# EAGLE design eps_flatsat_module (EAGLE 9.5.1)

## Sheet 1 of 2
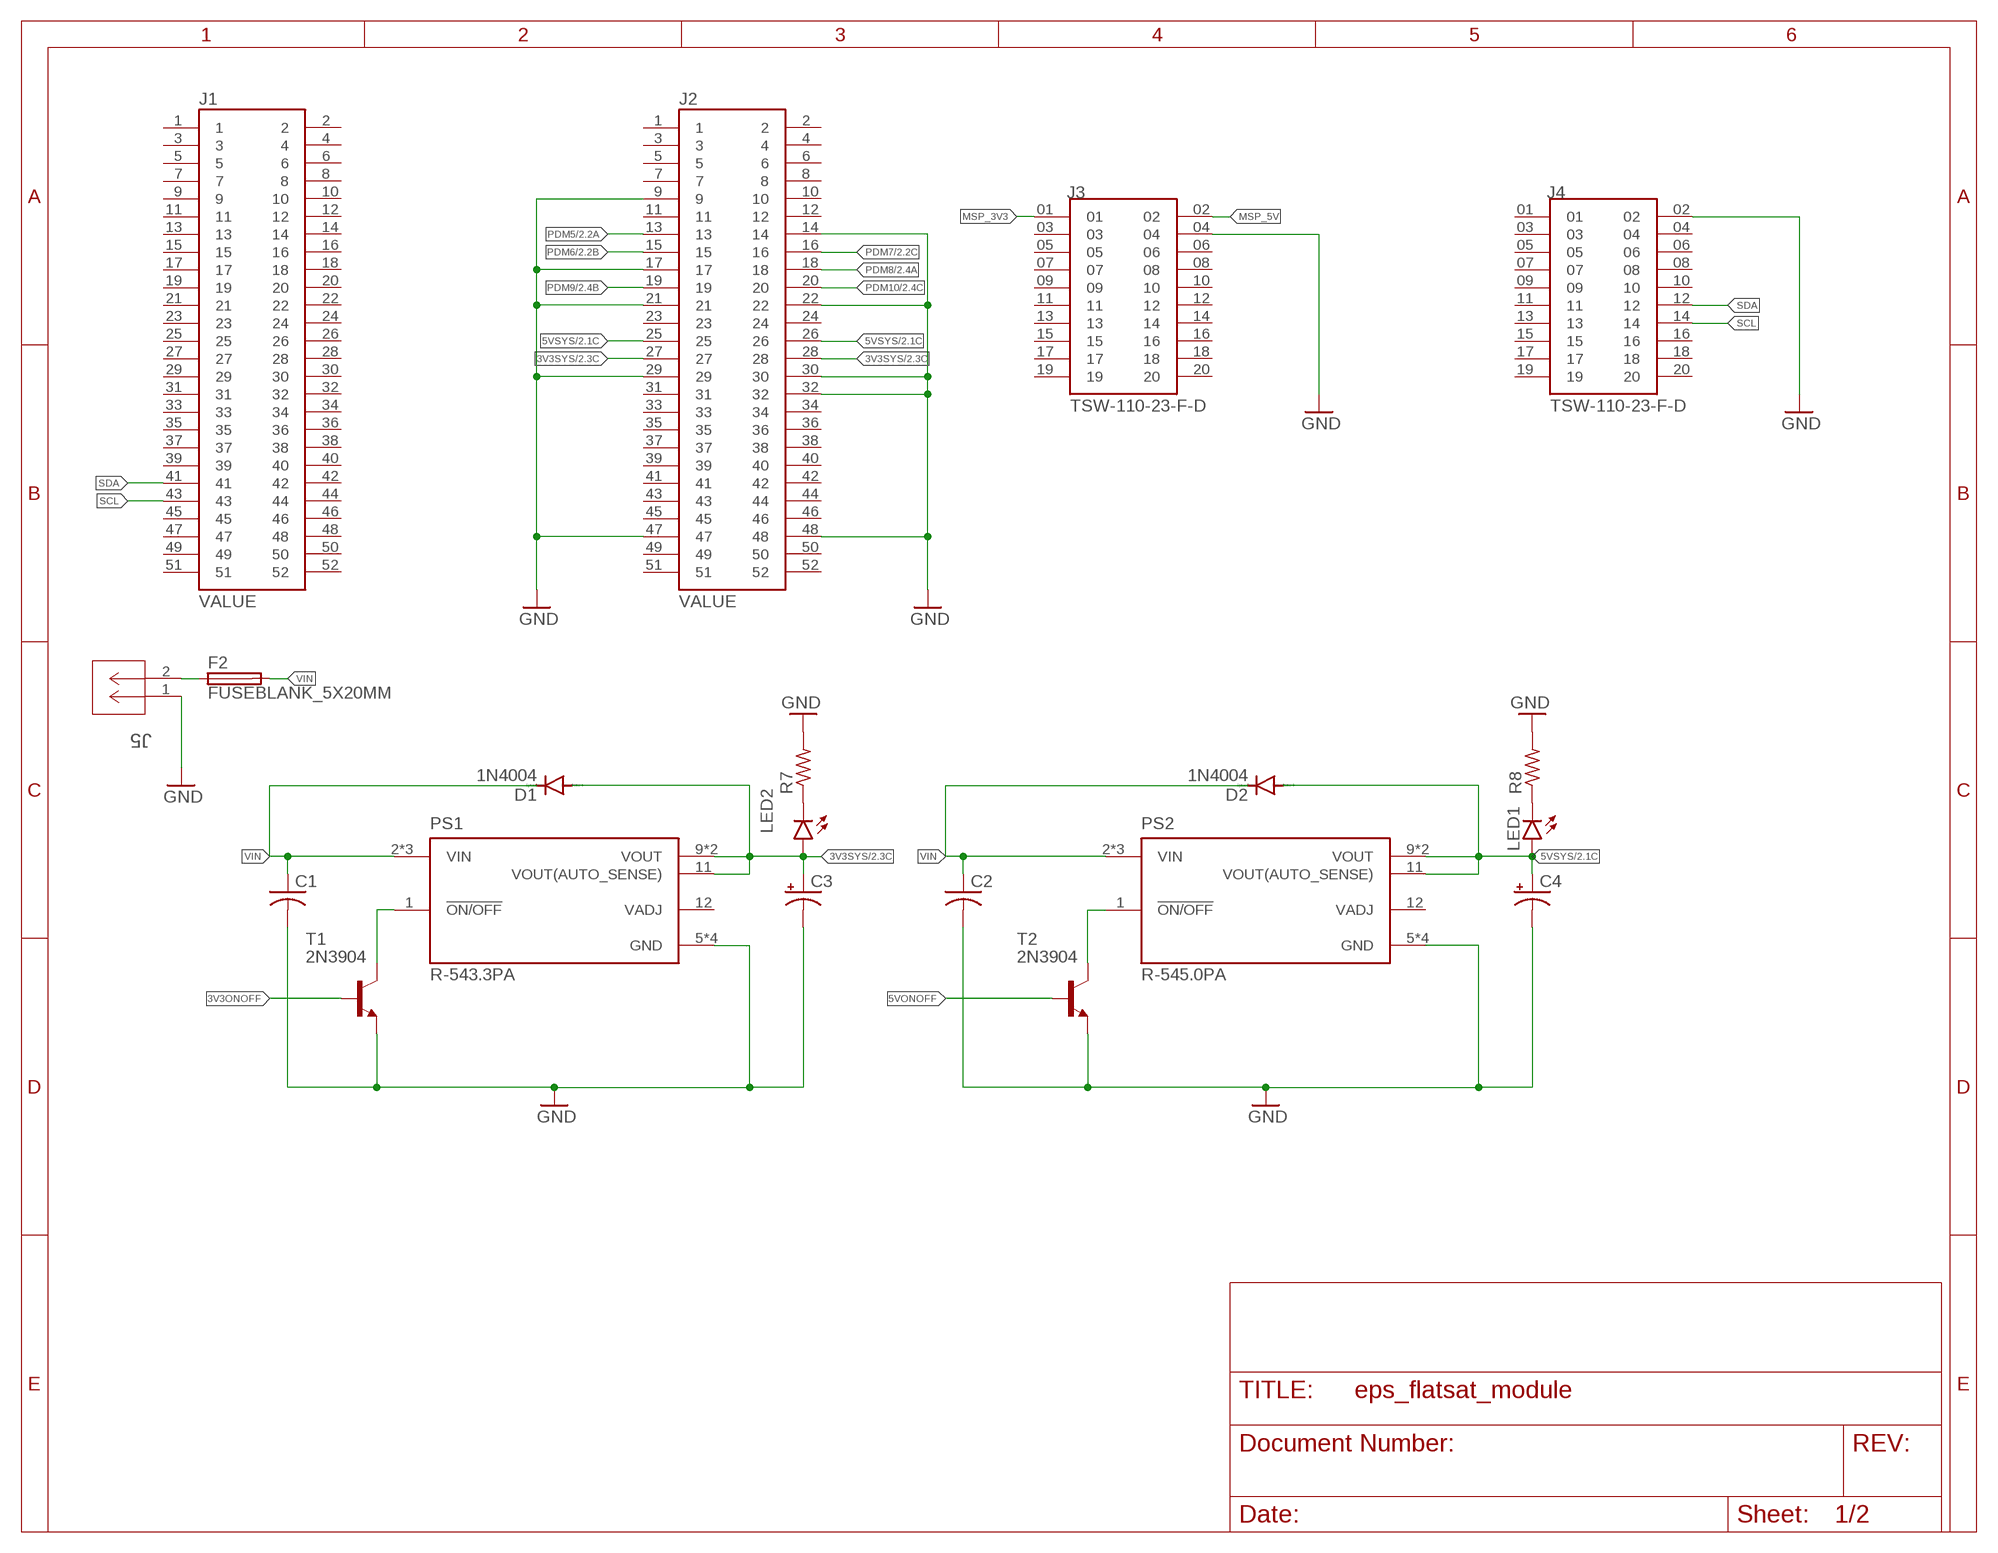
[diagram p0: schematic, sheet 1]

### Parts
C1  C-USC0805  [C0805]
C2  C-USC0805  [C0805]
C3  CPOL-USE2.5-6  [E2,5-6]
C4  CPOL-USE2.5-6  [E2,5-6]
D1  1N4004  [DO41-10]
D2  1N4004  [DO41-10]
F2  FUSEBLANK_5X20MM  [FUSE_HOLDER_5X20MM]
J1  ESQ-126-39-G-D  [SAMTEC_ESQ-126-39-G-D]
J2  ESQ-126-39-G-D  [SAMTEC_ESQ-126-39-G-D]
J3  TSW-110-23-F-D  [SAMTEC_TSW-110-23-F-D]
J4  TSW-110-23-F-D  [SAMTEC_TSW-110-23-F-D]
J5  1985881  [CONN_1715022_PXC]
LED1  LEDCHIPLED_0805  [CHIPLED_0805]
LED2  LEDCHIPLED_0805  [CHIPLED_0805]
PS1  R-543.3PA  [CONV_R-543.3PA]
PS2  R-545.0PA  [CONV_R-545.0PA]
R7  R-US_R0805  [R0805]
R8  R-US_R0805  [R0805]
T1  2N3904  [TO92]
T2  2N3904  [TO92]

### Nets
3V3ONOFF: T1.2(B)
3V3SYS [power]: C3.+ D1.A J2.27 J2.28 LED2.A PS1.9(VOUT) PS1.10(VOUT) PS1.11(VOUT(AUTO_SENSE)) ; also sheet 2
5VONOFF: T2.2(B)
5VSYS [power]: C4.+ D2.A J2.25 J2.26 LED1.A PS2.9(VOUT) PS2.10(VOUT) PS2.11(VOUT(AUTO_SENSE)) ; also sheet 2
GND [power]: C1.2 C2.2 C3.- C4.- J2.9 J2.14 J2.17 J2.21 J2.22 J2.29 J2.30 J2.32 J2.47 J2.48 J3.04 J4.02 J5.1 PS1.5(GND) PS1.6(GND) PS1.7(GND) PS1.8(GND) PS2.5(GND) PS2.6(GND) PS2.7(GND) PS2.8(GND) R7.2 R8.2 T1.3(E) T2.3(E) ; also sheet 2
MSP_3V3 [power]: J3.01
MSP_5V [power]: J3.02
N$1: PS1.1(!ON/OFF) T1.1(C)
N$2: PS2.1(!ON/OFF) T2.1(C)
N$9: LED1.C R8.1
N$10: LED2.C R7.1
N$17 [power]: F2.1 J5.2
PDM5 [power]: J2.13 ; also sheet 2
PDM6 [power]: J2.15 ; also sheet 2
PDM7 [power]: J2.16 ; also sheet 2
PDM8 [power]: J2.18 ; also sheet 2
PDM9 [power]: J2.19 ; also sheet 2
PDM10 [power]: J2.20 ; also sheet 2
SCL: J1.43 J4.14
SDA: J1.41 J4.12
VIN [power]: C1.1 C2.1 D1.C D2.C F2.2 PS1.2(VIN) PS1.3(VIN) PS1.4(VIN) PS2.2(VIN) PS2.3(VIN) PS2.4(VIN)
Unconnected: J1.1 J1.2 J1.3 J1.4 J1.5 J1.6 J1.7 J1.8 J1.9 J1.10 J1.11 J1.12 J1.13 J1.14 J1.15 J1.16 J1.17 J1.18 J1.19 J1.20 J1.21 J1.22 J1.23 J1.24 J1.25 J1.26 J1.27 J1.28 J1.29 J1.30 J1.31 J1.32 J1.33 J1.34 J1.35 J1.36 J1.37 J1.38 J1.39 J1.40 J1.42 J1.44 J1.45 J1.46 J1.47 J1.48 J1.49 J1.50 J1.51 J1.52 J2.1 J2.2 J2.3 J2.4 J2.5 J2.6 J2.7 J2.8 J2.10 J2.11 J2.12 J2.23 J2.24 J2.31 J2.33 J2.34 J2.35 J2.36 J2.37 J2.38 J2.39 J2.40 J2.41 J2.42 J2.43 J2.44 J2.45 J2.46 J2.49 J2.50 J2.51 J2.52 J3.03 J3.05 J3.06 J3.07 J3.08 J3.09 J3.10 J3.11 J3.12 J3.13 J3.14 J3.15 J3.16 J3.17 J3.18 J3.19 J3.20 J4.01 J4.03 J4.04 J4.05 J4.06 J4.07 J4.08 J4.09 J4.10 J4.11 J4.13 J4.15 J4.16 J4.17 J4.18 J4.19 J4.20 PS1.12(VADJ) PS2.12(VADJ)

## Sheet 2 of 2
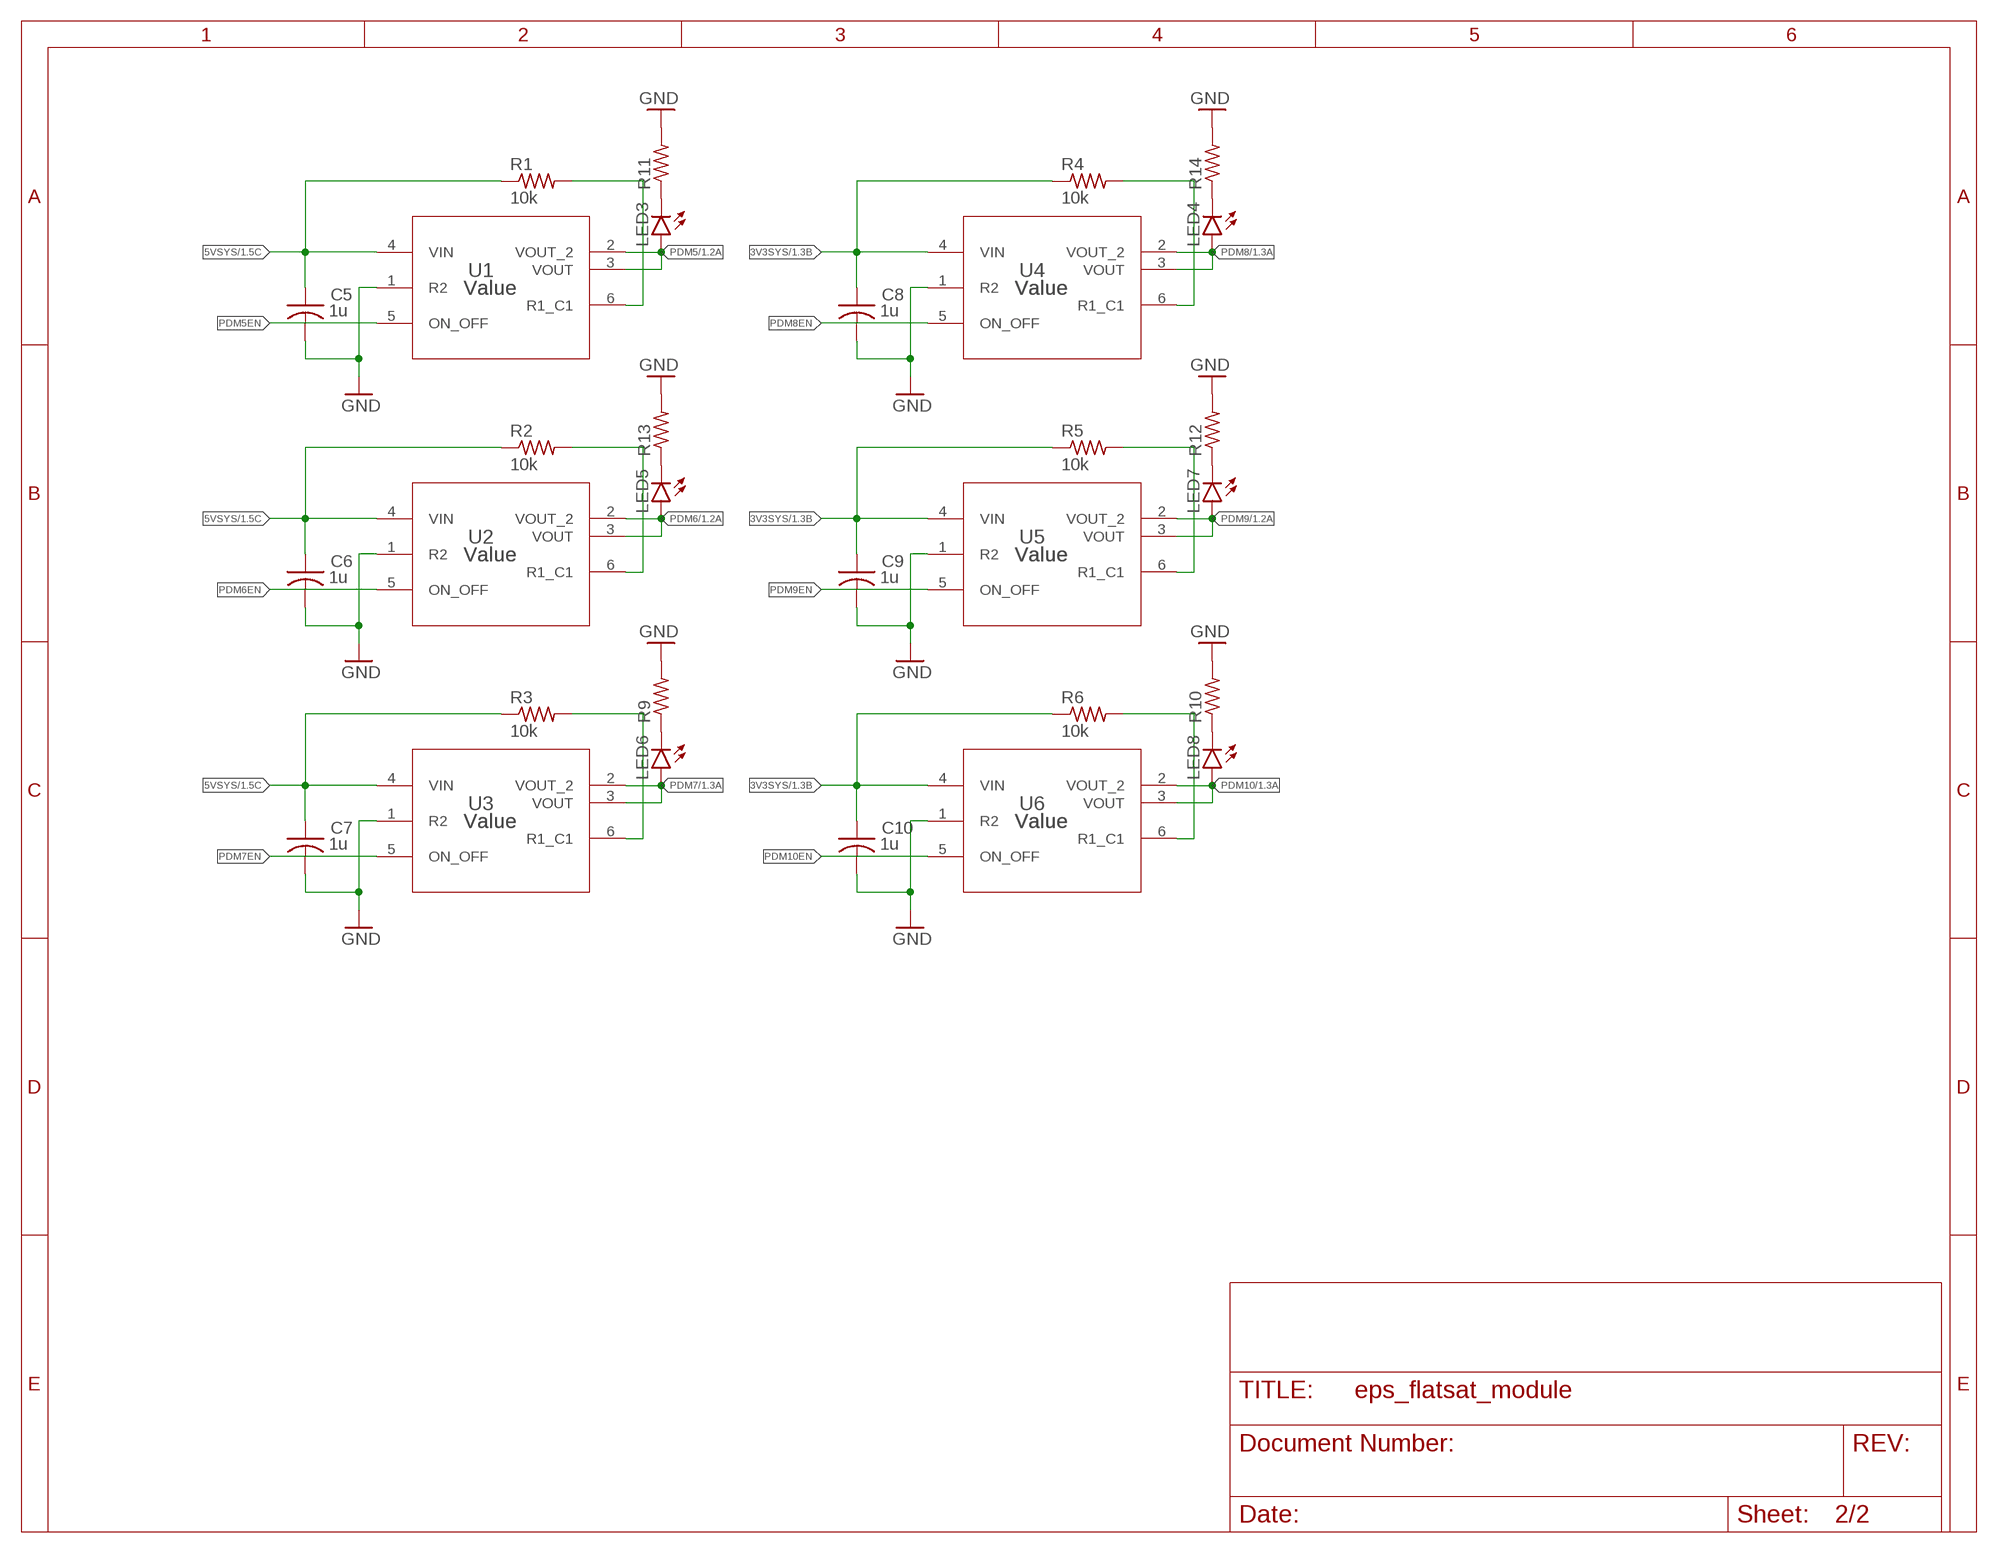
[diagram p1: schematic, sheet 2]

### Parts
C5  1u  C-USC0805  [C0805]
C6  1u  C-USC0805  [C0805]
C7  1u  C-USC0805  [C0805]
C8  1u  C-USC0805  [C0805]
C9  1u  C-USC0805  [C0805]
C10  1u  C-USC0805  [C0805]
LED3  LEDCHIPLED_0805  [CHIPLED_0805]
LED4  LEDCHIPLED_0805  [CHIPLED_0805]
LED5  LEDCHIPLED_0805  [CHIPLED_0805]
LED6  LEDCHIPLED_0805  [CHIPLED_0805]
LED7  LEDCHIPLED_0805  [CHIPLED_0805]
LED8  LEDCHIPLED_0805  [CHIPLED_0805]
R1  10k  R-US_R0805  [R0805]
R2  10k  R-US_R0805  [R0805]
R3  10k  R-US_R0805  [R0805]
R4  10k  R-US_R0805  [R0805]
R5  10k  R-US_R0805  [R0805]
R6  10k  R-US_R0805  [R0805]
R9  R-US_R0805  [R0805]
R10  R-US_R0805  [R0805]
R11  R-US_R0805  [R0805]
R12  R-US_R0805  [R0805]
R13  R-US_R0805  [R0805]
R14  R-US_R0805  [R0805]
U1  Value  TPS27081ADDCR  [DDC0006A_N]
U2  Value  TPS27081ADDCR  [DDC0006A_N]
U3  Value  TPS27081ADDCR  [DDC0006A_N]
U4  Value  TPS27081ADDCR  [DDC0006A_N]
U5  Value  TPS27081ADDCR  [DDC0006A_N]
U6  Value  TPS27081ADDCR  [DDC0006A_N]

### Nets
3V3SYS [power]: C8.1 C9.1 C10.1 R4.1 R5.1 R6.1 U4.4(VIN) U5.4(VIN) U6.4(VIN) ; also sheet 1
5VSYS [power]: C5.1 C6.1 C7.1 R1.1 R2.1 R3.1 U1.4(VIN) U2.4(VIN) U3.4(VIN) ; also sheet 1
GND [power]: C5.2 C6.2 C7.2 C8.2 C9.2 C10.2 R9.2 R10.2 R11.2 R12.2 R13.2 R14.2 U1.1(R2) U2.1(R2) U3.1(R2) U4.1(R2) U5.1(R2) U6.1(R2) ; also sheet 1
N$3: R1.2 U1.6(R1_C1)
N$4: R2.2 U2.6(R1_C1)
N$5: R3.2 U3.6(R1_C1)
N$6: R4.2 U4.6(R1_C1)
N$7: R5.2 U5.6(R1_C1)
N$8: R6.2 U6.6(R1_C1)
N$11: LED6.C R9.1
N$12: LED3.C R11.1
N$13: LED4.C R14.1
N$14: LED7.C R12.1
N$15: LED5.C R13.1
N$16: LED8.C R10.1
PDM5 [power]: LED3.A U1.2(VOUT_2) U1.3(VOUT) ; also sheet 1
PDM5EN: U1.5(ON_OFF)
PDM6 [power]: LED5.A U2.2(VOUT_2) U2.3(VOUT) ; also sheet 1
PDM6EN: U2.5(ON_OFF)
PDM7 [power]: LED6.A U3.2(VOUT_2) U3.3(VOUT) ; also sheet 1
PDM7EN: U3.5(ON_OFF)
PDM8 [power]: LED4.A U4.2(VOUT_2) U4.3(VOUT) ; also sheet 1
PDM8EN: U4.5(ON_OFF)
PDM9 [power]: LED7.A U5.2(VOUT_2) U5.3(VOUT) ; also sheet 1
PDM9EN: U5.5(ON_OFF)
PDM10 [power]: LED8.A U6.2(VOUT_2) U6.3(VOUT) ; also sheet 1
PDM10EN: U6.5(ON_OFF)

## Library data of the parts
C1 C2 C5-C10 = rcl:C-US: CAPACITOR, American symbol; SPICEPREFIX: C
C3 C4 = rcl:CPOL-US: POLARIZED CAPACITOR, American symbol; SPICEPREFIX: C
D1 D2 = diode:1N4004: DIODE general purpose rectifier, 1 A
F2 = fuse:FUSE: Fuse; OC_FARNELL: unknown; OC_NEWARK: unknown
J1 J2 = ESQ-126-39-G-D:ESQ-126-39-G-D: Conn Elevated Socket SKT 52 POS 2.54mm Solder ST Thru-Hole Tube; DESCRIPTION: 52 Position Elevated Socket Connector Through Hole; DIGI-KEY_PART_NUMBER: SAM10462-ND; DIGI-KEY_PURCHASE_URL: https://www.digikey.com/product-detail/en/samtec-inc/ESQ-126-39-G-D/SAM10462-ND/3601055?utm_source=snapeda&utm_medium=aggregator&utm_campaign=symbol; MF: Samtec; MP: ESQ-126-39-G-D; PACKAGE: None
J3 J4 = TSW-110-23-F-D:TSW-110-23-F-D; MANUFACTURER: Samtec; PARTREV: R; STANDARD: Manufacturer Recommendations
J5 = 1985881:1985881; ARTICLE_DESCRIPTION: MKDS 1,5/ 2 HT BK; BUILT_BY: EMA_Matt; CONTACT_TYPE: Unknown; COPYRIGHT: Copyright (C) 2018 Accelerated Designs. All rights reserved; MANUFACTURER_PART_NUMBER: 1985881; NUMBER_OF_CONNECTION: 2; NUMBER_OF_POSITION_PER_ROW: 2; NUMBER_OF_POTENTIALS: 2; NUMBER_OF_ROWS: 1; NUMBER_OF_SOLDER_PINS_PER_POTENTIALS: 1; PITCH__MM_: 5; PLUG_SYSTEM: Unknown; PRODUCTTYP: Printed circuit board terminal; PRODUCT_FAMILY: MKDS 1,5/..-HT; SOLDER_PIN_LENGTH__MM_: 3.5; SOURCELIBRARY: Phoenix_Contact_2020-03-19; VENDOR: Phoenix Contact
LED1-LED8 = led:LED: LED OSRAM: - CHIPLED LG R971, LG N971, LY N971, LG Q971, LY Q971, LO R971, LY R971 LH N974, LH R974 LS Q976, LO Q976, LY Q976 LO Q996 - Hyper CHIPLED LW Q18S LB Q993, LB Q99A, LB R99A - SideLED LS A670, LO A670, LY A670, LG A670, LP A670 LB A673, LV A673, LT A673, LW A673 LH A674 LY A675 LS A676, LA A676, LO A676, LY A676, LW A676 LS A679, LY A679, LG A679 - Hyper Micro SIDELED® LS Y876, LA Y876, LO Y876, LY Y876 LT Y87S - SmartLED LW L88C, LW L88S LB L89C, LB L89S, LG L890 LS L89K, LO L89K, LY L89K LS L896, LA L896, LO L896, LY L896 - TOPLED LS T670, LO T670, LY T670, LG T670, LP T670 LSG T670, LSP T670, LSY T670, LOP T670, LYG T670 LG T671, LOG T671, LSG T671 LB T673, LV T673, LT T673, LW T673 LH T674 LS T676, LA T676, LO T676, LY T676, LB T676, LH T676, LSB T676, LW T676 LB T67C, LV T67C, LT T67C, LS T67K, LO T67K, LY T67K, LW E67C LS E67B, LA E67B, LO E67B, LY E67B, LB E67C, LV E67C, LT E67C LW T67C LS T679, LY T679, LG T679 LS T770, LO T770, LY T770, LG T770, LP T770 LB T773, LV T773, LT T773, LW T773 LH T774 LS E675, LA E675, LY E675, LS T675 LS T776, LA T776, LO T776, LY T776, LB T776 LHGB T686 LT T68C, LB T68C - Hyper Mini TOPLED® LB M676 - Mini TOPLED Santana® LG M470 LS M47K, LO M47K, LY M47K Source: http://www.osram.convergy.de LUXEON: - LUMILED® LXK2-PW12-R00, LXK2-PW12-S00, LXK2-PW14-U00, LXK2-PW14-V00 LXK2-PM12-R00, LXK2-PM12-S00, LXK2-PM14-U00 LXK2-PE12-Q00, LXK2-PE12-R00, LXK2-PE12-S00, LXK2-PE14-T00, LXK2-PE14-U00 LXK2-PB12-K00, LXK2-PB12-L00, LXK2-PB12-M00, LXK2-PB14-N00, LXK2-PB14-P00, LXK2-PB14-Q00 LXK2-PR12-L00, LXK2-PR12-M00, LXK2-PR14-Q00, LXK2-PR14-R00 LXK2-PD12-Q00, LXK2-PD12-R00, LXK2-PD12-S00 LXK2-PH12-R00, LXK2-PH12-S00 LXK2-PL12-P00, LXK2-PL12-Q00, LXK2-PL12-R00 Source: www.luxeon.com KINGBRIGHT: KA-3528ASYC Source: www.kingbright.com
PS1 = R-543.3PA:R-543.3PA: 2,3,4,5 Amp SIP12 Vertical & Horizontal Single Output; DESCRIPTION: 4A DC/DC-Converter 'INNOLINE' SIP12 reg; DIGI-KEY_PART_NUMBER: 945-1599-5-ND; DIGIKEY-PURCHASE-URL: https://snapeda.com/shop?store=DigiKey&id=3630570; MF: Recom Power; MP: R-543.3PA; PACKAGE: SIP-12 Recom Power
PS2 = R-545.0PA:R-545.0PA: 2,3,4,5 Amp SIP12 Vertical & Horizontal Single Output; DESCRIPTION: 4A DC/DC-Converter 'INNOLINE' SIP12 reg; DIGI-KEY_PART_NUMBER: R-545.0PA-ND; MF: Recom Power; MP: R-545.0PA; PACKAGE: SIP-12 Recom Power
R1-R14 = rcl:R-US_: RESISTOR, American symbol; SPICEPREFIX: R
T1 T2 = transistor:2N3904: NPN TRANSISTOR
U1-U6 = TPS27081ADDCR:TPS27081ADDCR; APPLICATION_BUILDNUMBER: *; COMPTYPE: IC; MANUFACTURER: Texas Instruments; MOUNTTYPE: SMT; PACKAGEREFERENCE: DDC0006A; PARTNUMBER: TPS27081ADDCR; PIN_COUNT: 6; REFDES: RefDes; ROHS: Y; TYPE: TYPE

## Net classes
1 power: width 0.203 mm

## Board
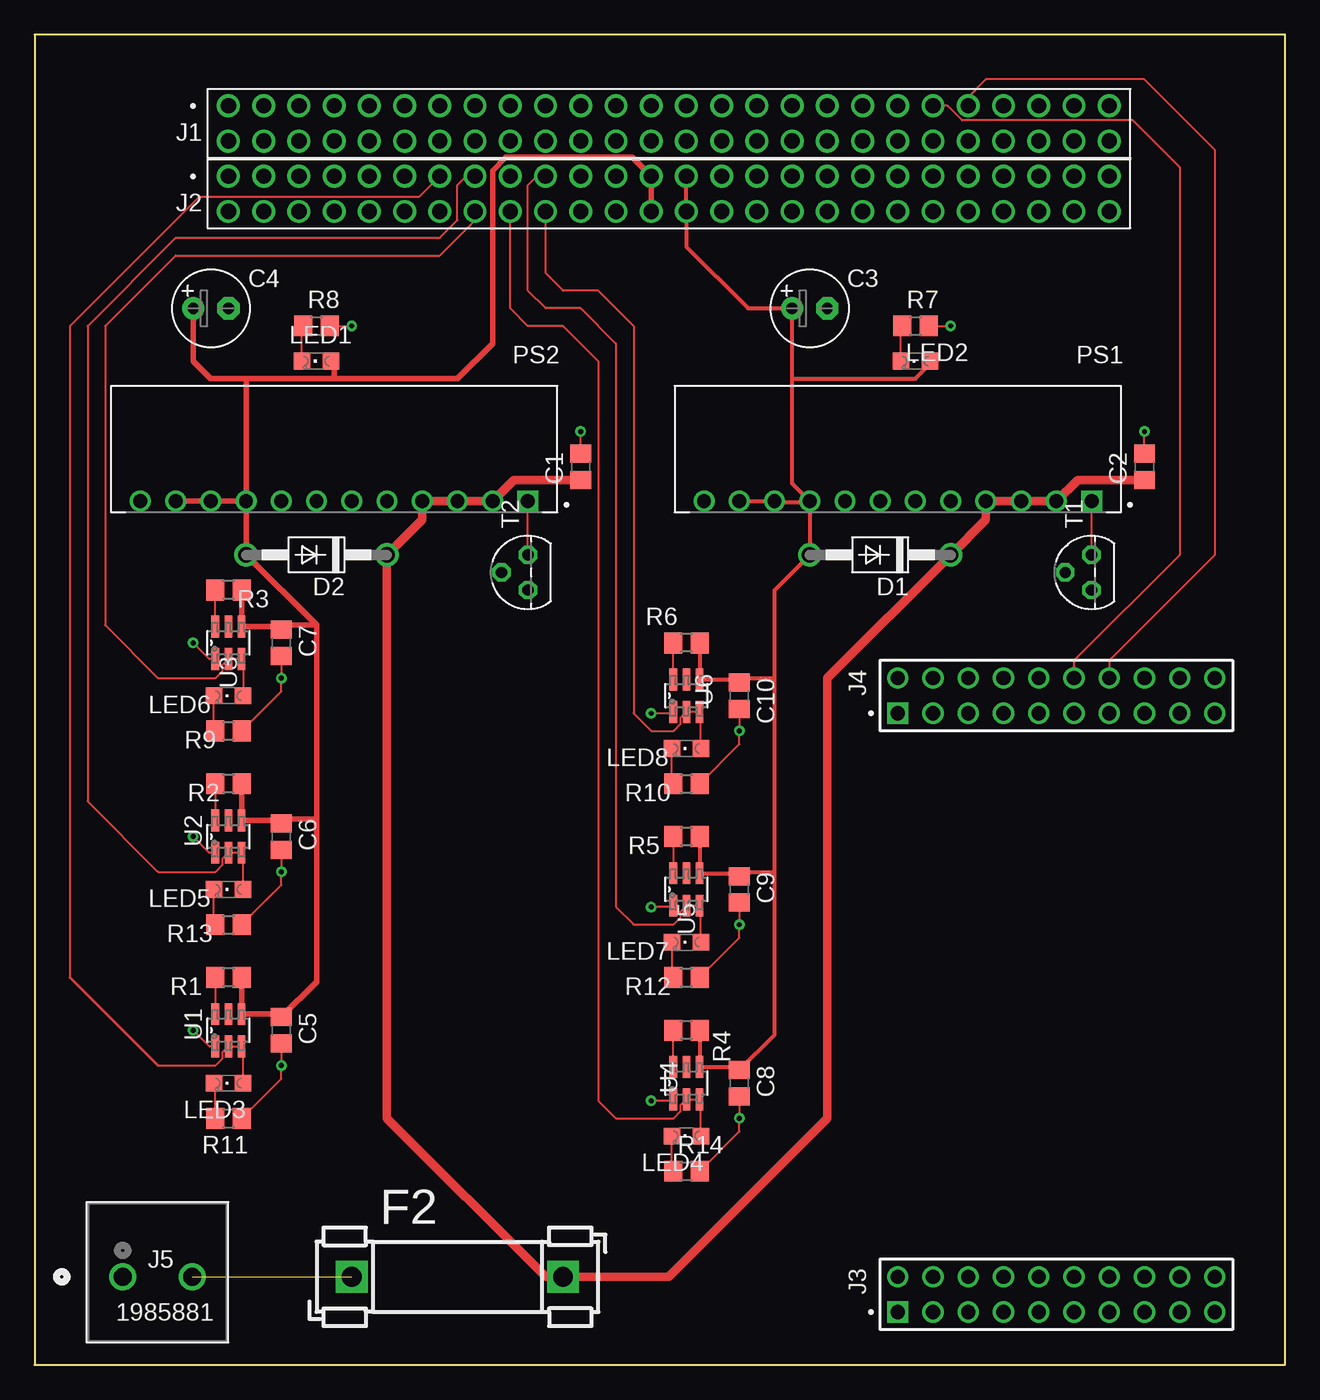
[diagram p2: board, top side]
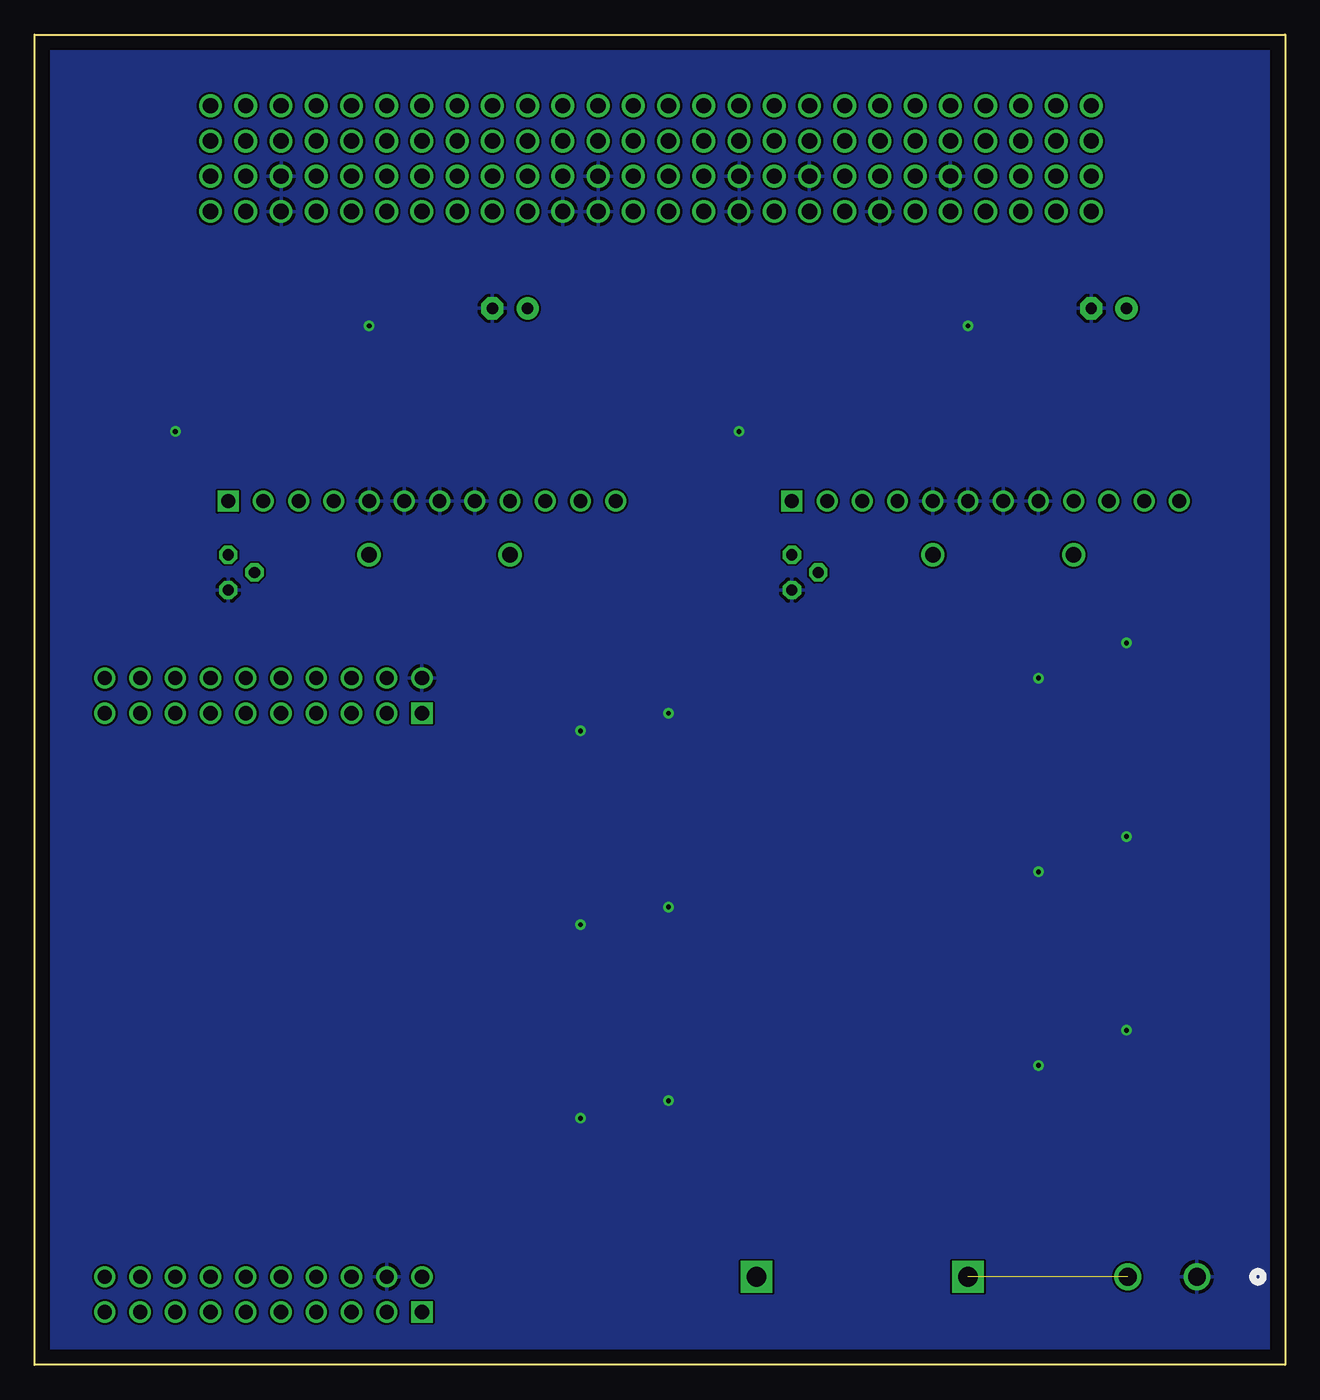
[diagram p3: board, bottom side, seen from below]

Size 90.15 x 95.94 mm. Coordinates in mm from the lower left corner, seen from the top.
Outline: 0,95.94 0,0 90.15,0 90.15,95.94 0,95.94
Copper layers (1*16): Top 0.035mm / dielectric 1.5mm / Bottom 0.035mm
Design rules "default": minimum track width 6mil, minimum drill 0.35mm, track to track 6mil, track to pad 6mil, pad to pad 6mil, via to via 6mil, smd to smd 6mil, copper to edge 40mil, drill to drill 6mil, minimum pad ring 10mil, minimum via ring 8mil, stop-mask expansion 4mil, vias tented up to drill 0mil, thermal gap 10mil

### Footprints (pad centres in the part's own frame; a part is rotated, then mirrored left to right if it is on the bottom)
C0805 = smd 1.3 x 1.5: 1 -0.95,0; 2 0.95,0
E2,5-6 = drill 0.813 pad 1.6: + -1.27,0 | drill 0.813 pad 1.6 octagon: - 1.27,0
DO41-10 = drill 1.118: A 5.08,0; C -5.08,0
FUSE_HOLDER_5X20MM = drill 1.422 pad 2.286 square: 1 0,0; 2 15.24,0
SAMTEC_ESQ-126-39-G-D = drill 1.1: 1 0,0; 2 0,-2.54; 3 2.54,0; 4 2.54,-2.54; 5 5.08,0; 6 5.08,-2.54; 7 7.62,0; 8 7.62,-2.54; 9 10.16,0; 10 10.16,-2.54; 11 12.7,0; 12 12.7,-2.54; 13 15.24,0; 14 15.24,-2.54; 15 17.78,0; 16 17.78,-2.54; 17 20.32,0; 18 20.32,-2.54; 19 22.86,0; 20 22.86,-2.54; 21 25.4,0; 22 25.4,-2.54; 23 27.94,0; 24 27.94,-2.54; 25 30.48,0; 26 30.48,-2.54; 27 33.02,0; 28 33.02,-2.54; 29 35.56,0; 30 35.56,-2.54; 31 38.1,0; 32 38.1,-2.54; 33 40.64,0; 34 40.64,-2.54; 35 43.18,0; 36 43.18,-2.54; 37 45.72,0; 38 45.72,-2.54; 39 48.26,0; 40 48.26,-2.54; 41 50.8,0; 42 50.8,-2.54; 43 53.34,0; 44 53.34,-2.54; 45 55.88,0; 46 55.88,-2.54; 47 58.42,0; 48 58.42,-2.54; 49 60.96,0; 50 60.96,-2.54; 51 63.5,0; 52 63.5,-2.54
SAMTEC_TSW-110-23-F-D = drill 1.02 pad 1.37 square: 01 0,0 | drill 1.02 pad 1.37: 02 0,2.54; 03 2.54,0; 04 2.54,2.54; 05 5.08,0; 06 5.08,2.54; 07 7.62,0; 08 7.62,2.54; 09 10.16,0; 10 10.16,2.54; 11 12.7,0; 12 12.7,2.54; 13 15.24,0; 14 15.24,2.54; 15 17.78,0; 16 17.78,2.54; 17 20.32,0; 18 20.32,2.54; 19 22.86,0; 20 22.86,2.54
CONN_1715022_PXC = drill 1.295 pad 1.803: 1 0,0; 2 5.004,0
CHIPLED_0805 = smd 1.2 x 1.2: A 0,-1.05; C 0,1.05
CONV_R-543.3PA = drill 1 square: 1 -13.97,3.75 | drill 1: 2 -11.43,3.75; 3 -8.89,3.75; 4 -6.35,3.75; 5 -3.81,3.75; 6 -1.27,3.75; 7 1.27,3.75; 8 3.81,3.75; 9 6.35,3.75; 10 8.89,3.75; 11 11.43,3.75; 12 13.97,3.75
CONV_R-545.0PA = drill 1 square: 1 -13.97,3.75 | drill 1: 2 -11.43,3.75; 3 -8.89,3.75; 4 -6.35,3.75; 5 -3.81,3.75; 6 -1.27,3.75; 7 1.27,3.75; 8 3.81,3.75; 9 6.35,3.75; 10 8.89,3.75; 11 11.43,3.75; 12 13.97,3.75
R0805 = smd 1.3 x 1.5: 1 -0.95,0; 2 0.95,0
TO92 = drill 0.813 octagon: 1 1.27,0; 2 0,1.905; 3 -1.27,0
DDC0006A_N = smd 1.575 x 0.559: 1 -1.168,0.95; 2 -1.168,0; 3 -1.168,-0.95; 4 1.168,-0.95; 5 1.168,0; 6 1.168,0.95

### Placement (x,y rotation side)
C1  39.37,64.77 90 top
C2  80.01,64.77 90 top
C3  55.88,76.2 0 top
C4  12.7,76.2 0 top
C5  17.78,24.13 270 top
C6  17.78,38.1 270 top
C7  17.78,52.07 270 top
C8  50.8,20.32 270 top
C9  50.8,34.29 270 top
C10  50.8,48.26 270 top
D1  60.96,58.42 180 top
D2  20.32,58.42 180 top
F2  22.86,6.35 0 top
J1  13.97,90.81 0 top
J2  13.97,85.72 0 top
J3  62.23,3.81 0 top
J4  62.23,46.99 0 top
J5  6.35,6.35 0 top
LED1  20.32,72.39 90 top
LED2  63.5,72.39 90 top
LED3  13.97,20.32 90 top
LED4  46.99,16.51 90 top
LED5  13.97,34.29 90 top
LED6  13.97,48.26 90 top
LED7  46.99,30.48 90 top
LED8  46.99,44.45 90 top
PS1  62.23,66.04 180 top
PS2  21.59,66.04 180 top
R1  13.97,27.94 180 top
R2  13.97,41.91 180 top
R3  13.97,55.88 180 top
R4  46.99,24.13 180 top
R5  46.99,38.1 180 top
R6  46.99,52.07 180 top
R7  63.5,74.93 0 top
R8  20.32,74.93 0 top
R9  13.97,45.72 0 top
R10  46.99,41.91 0 top
R11  13.97,17.78 0 top
R12  46.99,27.94 0 top
R13  13.97,31.75 0 top
R14  46.99,13.97 0 top
T1  76.2,57.15 90 top
T2  35.56,57.15 90 top
U1  13.97,24.13 90 top
U2  13.97,38.1 90 top
U3  13.97,52.07 90 top
U4  46.99,20.32 90 top
U5  46.99,34.29 90 top
U6  46.99,48.26 90 top

### Tracks (layer width: path | path; a pad name or v marks a point on that pad's centre or on a via)
3V3SYS
  Top 0.152: 55.88,62.23 PS1.9 | 50.64,35.4 C9.1 | 50.58,49.43 C10.1 50.96,49.37 51.12,49.53
  Top 0.305: R4.1 U4.4 50.58,21.49 | 50.64,35.4 50.58,35.46 U5.4 R5.1 | 50.96,49.37 50.9,49.43 U6.4 R6.1 | C8.1 53.34,23.81 53.34,35.56 | 53.34,35.56 53.34,49.53 | C9.1 51.12,35.56 53.34,35.56 | C10.1 51.12,49.53 53.34,49.53 | PS1.11 PS1.10 53.4,62.23 55.88,62.23 | 54.61,71.12 54.61,63.56 PS1.9 D1.A 53.34,55.88 53.34,49.53 | 54.61,71.12 C3.+ 51.44,76.2 46.99,80.64 J2.28 J2.27 | 54.61,71.12 63.5,71.12 64.55,72.17 LED2.A
  Top 0.406: 50.58,21.49 C8.1
5VSYS
  Top 0.152: 17.62,25.24 C5.1
  Top 0.406: R1.1 U1.4 17.56,25.3 17.62,25.24 | C5.1 20.32,27.62 20.32,39.37 | PS2.9 D2.A 20.32,53.34 | PS2.9 PS2.10 PS2.11 | R3.1 U3.4 17.56,53.24 C7.1 18.1,53.34 20.32,53.34 | R2.1 U2.4 17.56,39.27 C6.1 18.1,39.37 20.32,39.37 | PS2.9 15.24,71.12 | 15.24,71.12 21.59,71.12 | 21.59,71.12 30.48,71.12 33.02,73.66 33.02,86.12 33.98,87.08 43.09,87.08 J2.25 J2.26 | LED1.A 21.59,72.17 21.59,71.12 | 15.24,71.12 12.7,71.12 11.43,72.39 C4.+ | 20.32,39.37 20.32,53.34
GND  (via drill 0.35)
  Top 0.152: R7.2 v66.04,74.93 | C2.2 v80.01,67.31 | R12.2 50.8,30.8 v50.8,31.75 C9.2 | R10.2 50.8,44.77 v50.8,45.72 C10.2 | R14.2 50.8,16.83 v50.8,17.78 C8.2 | R11.2 17.78,20.64 v17.78,21.59 C5.2 | R13.2 17.78,34.61 v17.78,35.56 C6.2 | R9.2 17.78,48.58 v17.78,49.53 C7.2 | U2.1 12.6,36.93 v11.43,38.1 | U3.1 12.6,50.9 v11.43,52.07 | U1.1 12.6,22.96 v11.43,24.13 | C1.2 v39.37,67.31 | R8.2 v22.86,74.93 | U5.1 45.94,33.02 v44.45,33.02 | U4.1 45.94,19.05 v44.45,19.05 | U6.1 45.94,46.99 v44.45,46.99
  pour Bottom: -6.35,100.33 104.14,100.33 104.14,19.05 104.14,-8.89 -8.89,-8.89 -8.89,100.33
N$1
  Top 0.152: T1.1 PS1.1
N$2
  Top 0.152: T2.1 PS2.1
N$3
  Top 0.152: R1.2 U1.6
N$4
  Top 0.152: R2.2 U2.6
N$5
  Top 0.152: U3.6 R3.2
N$6
  Top 0.152: U4.6 R4.2
N$7
  Top 0.152: R5.2 U5.6
N$8
  Top 0.152: U6.6 R6.2
N$9
  Top 0.152: LED1.C 19.27,74.83 R8.1
N$10
  Top 0.152: LED2.C 62.45,74.83 R7.1
N$11
  Top 0.152: R9.1 12.92,45.82 LED6.C
N$12
  Top 0.152: R11.1 13.02,20.22 LED3.C
N$13
  Top 0.152: R14.1 45.94,14.07 LED4.C
N$14
  Top 0.152: LED7.C 45.94,28.04 R12.1
N$15
  Top 0.152: R13.1 12.92,31.85 LED5.C
N$16
  Top 0.152: R10.1 45.94,42.01 LED8.C
N$17  (1 unrouted)
PDM5
  Top 0.152: LED3.A 15.02,22.86 U1.3 U1.2 13.53,22.52 13.53,22.08 13.04,21.59 8.89,21.59 | J2.13 27.72,84.24 11.85,84.24 2.54,74.93 2.54,27.94
  Top 0.203: 2.54,27.94 8.89,21.59
PDM6
  Top 0.152: LED5.A 15.02,36.83 U2.3 U2.2 13.53,36.49 13.53,36.05 13.04,35.56 8.89,35.56 3.81,40.64 3.81,74.93 10.16,81.28 29.21,81.28 30.48,82.55 30.48,85.09 31.11,85.72 J2.15
PDM7
  Top 0.152: LED6.A 15.02,50.8 U3.3 U3.2 13.53,50.46 13.53,50.02 13.04,49.53 8.89,49.53 5.08,53.34 5.08,74.93 10.16,80.01 29.21,80.01 31.75,82.55 J2.16
PDM8
  Top 0.152: LED4.A 48.04,19.05 U4.3 U4.2 46.55,18.71 46.55,18.27 46.06,17.78 41.91,17.78 40.64,19.05 40.64,72.39 38.1,74.93 35.56,74.93 34.29,76.2 J2.18
PDM9
  Top 0.152: LED7.A 48.04,33.02 U5.3 U5.2 46.55,32.68 46.55,32.24 46.06,31.75 43.18,31.75 41.91,33.02 41.91,73.66 39.37,76.2 36.83,76.2 35.56,77.47 35.56,85.09 36.2,85.72 J2.19
PDM10
  Top 0.152: LED8.A 48.04,46.99 U6.3 U6.2 46.55,46.65 46.55,46.21 46.06,45.72 44.45,45.72 43.18,46.99 43.18,74.93 40.64,77.47 38.1,77.47 36.83,78.74 J2.20
SCL
  Top 0.152: J1.43 67.31,91.44 68.58,92.71 80.01,92.71 85.09,87.63 85.09,58.42 77.47,50.8 J4.14
SDA
  Top 0.152: J1.41 65.82,90.81 66.87,89.75 79.16,89.75 82.55,86.36 82.55,58.42 74.93,50.8 J4.12
VIN
  Top 0.61: C2.1 75.19,63.82 PS1.2 PS1.3 PS1.4 68.58,60.96 D1.C 57.15,49.53 57.15,17.78 45.72,6.35 F2.2 36.83,6.35 25.4,17.78 D2.C 27.94,60.96 PS2.4 PS2.3 PS2.2 34.55,63.82 C1.1

### Text on the board
tDocu: UW AACT | SOC-I | MSP 430